# Altium schematic sheet APM9328_PS_Reset.SchDoc: POWER SUPPLY & RESET
size A4; Author: NC; Revision: 1.0; SheetNumber: 2; SheetTotal: 14
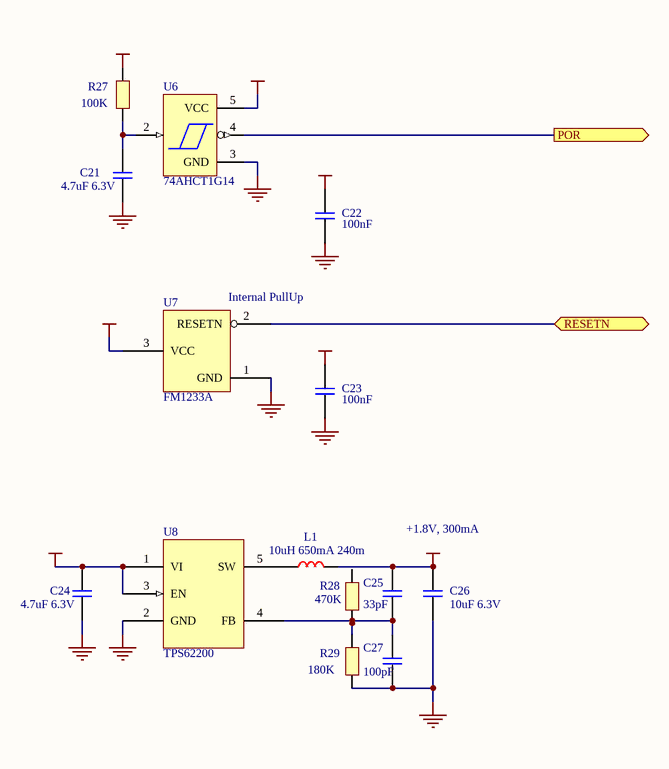
[diagram p0: APM9328_PS_Reset.SchDoc]

## Parts
C21  4.7uF 6.3V  [0805]
C22  100nF  [0402]
C23  100nF  [0402]
C24  4.7uF 6.3V  [0805]
C25  33pF  [0402]
C26  10uF 6.3V  [0805]
C27  100pF  [0402]
L1  10uH 650mA 240m  [Self_1812]
R27  100K  [0402]
R28  470K  [0402]
R29  180K  [0402]
U6  74AHCT1G14  [SC70-5]
U7  FM1233A  [SOT23-3]
U8  TPS62200  [SOT23-5]

## Ports
POR (out), RESETN (bidir)

## Nets
+1V8: C25.2 C26.2 L1.2
+3V3: C22.1 C23.1 C24.2 R27.2 U6.5(VCC) U7.3(VCC) U8.1(VI) U8.3(EN)
GND: C21.1 C22.2 C23.2 C24.1 C26.1 C27.1 R29.1 U6.3(GND) U7.1(GND) U8.2(GND)
POR: U6.4 ; port POR
RESETN: U7.2(RESETN) ; port RESETN
NetC21_2: C21.2 R27.1 U6.2
NetC25_1: C25.1 C27.2 R28.1 R29.2 U8.4(FB)
NetL1_1: L1.1 U8.5(SW)

Not connected (* = marked no-connect by the designer): R28 2; U6 1(NC)

## Notes on the sheet
- (near U7) Internal PullUp
- +1.8V, 300mA
- Title
- Size:
- Date:
- A4
- Author:
- Revision:
- Sheet
- of
- Armadeus Embedded Solutions
- File:

## Library data of the parts
C21 C24 = Cap: Ceramic Capacitor; Manufacturer: Kemet; Part Number: C0805C475K8PACTU; Distributor: Mouser
  C21: Price: *; Second Source: *; Assemby Option: *
  C24: Price_100: 0,3; Price_500: 0,11; Price_1000: 0,09
C22 C23 C25 C27 = Cap
C26 = Cap: Ceramic Capacitor; Manufacturer: *; Part Number: *; Distributor: *; Second Source: *; Price: *; Assembly Option: *
L1 = Self: Manufacturer: Murata; Part Number: LQH43CN100K03L; Distributor: Mouser; Price_100: 0,31; Price_500: 0,18; Price_1000: 0,17
R27 = Res: Manufacturer: KOA; Part Number: *; Distributor: Mouser; Price_100: 0,03; Price_500: 0,025; Price_1000: 0,02
R28 R29 = Res
U6 = 74AHCT1G14: Single Gate Inverter; Manufacturer: Texas Instrument; Part Number: SN74AHC1G14DCK; Second Source: NC7SV14 (Fairchild); Distributor: Digikey; Price_100: 0,216; Price_500: 0,126; Price_1000: 0,108
U7 = FM1233: Reset IC; Manufacturer: Fairchild; Part Number: FM1233ACS3X; Distributor: Mouser; Price_1000: 0,3; Price_500: 0,36; Price_100: 0,6
U8 = TPS62200: High Efficiency DC/DC converter; Manufacturer: Texas Instrument; Part Number: TPS62200DBV; Second Source: LM3670; Distributor: Digikey; Price_100: 1,68; Price_500: 1,56; Price_1000: 1,53